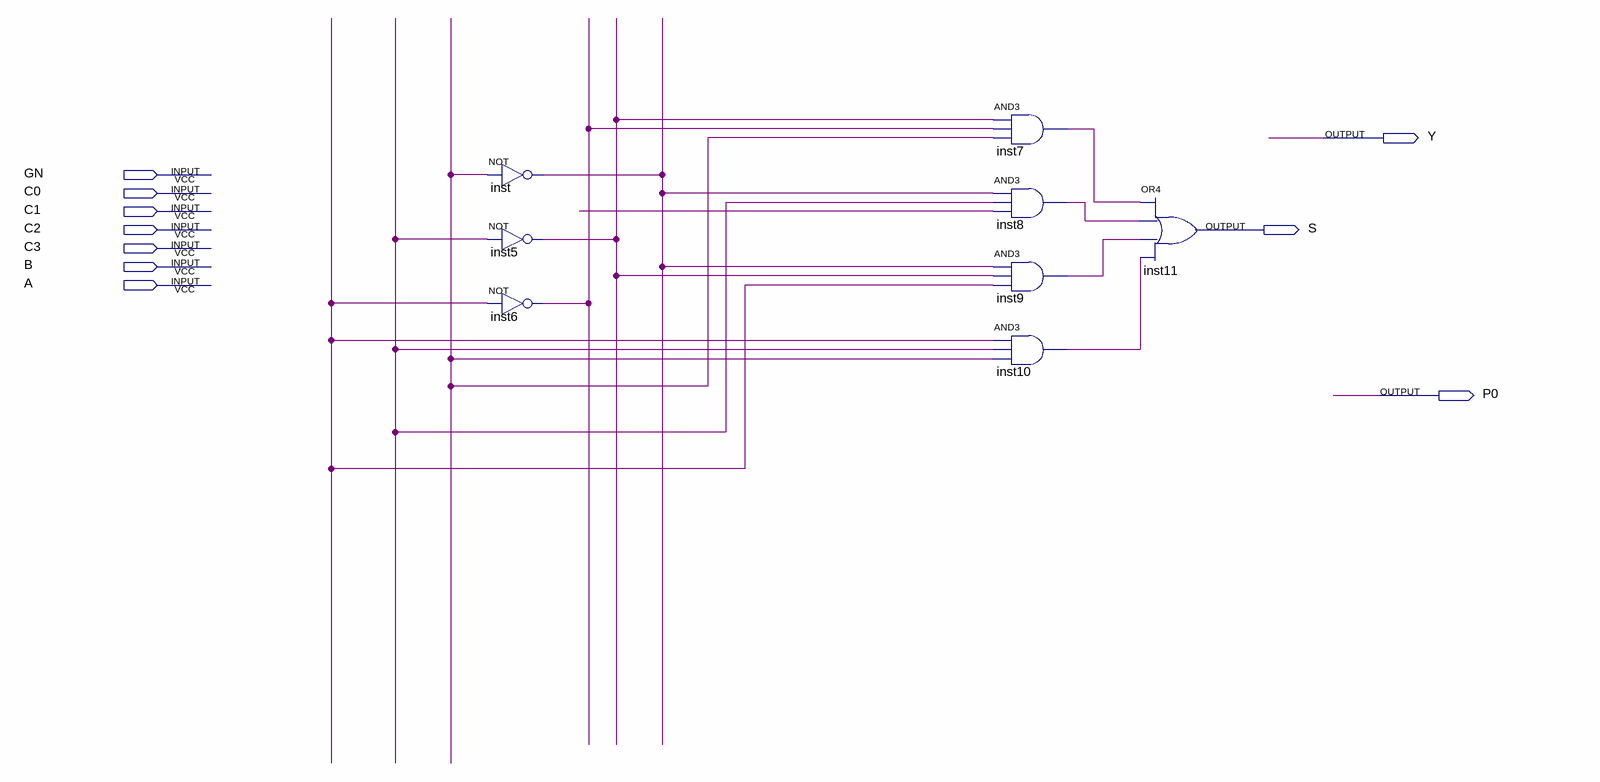
[diagram p0: schematic sheet]
// Quartus schematic CMB5.bdf as structural Verilog: 8 symbols, 10 pins
module CMB5 (
  input  GN,
  input  C0,
  input  C1,
  input  C2,
  input  C3,
  input  B,
  input  A,
  output Y,
  output S,
  output P0
);

  wire inst5_out, inst6_out, inst7_out, inst8_out, inst9_out, inst10_out, inst_out, undriven, undriven_2,
       undriven_3, undriven_4;

  not inst (inst_out, undriven_4);
  not inst5 (inst5_out, undriven_3);
  not inst6 (inst6_out, undriven_2);
  and inst7 (inst7_out, inst5_out, inst6_out, undriven_4);
  and inst8 (inst8_out, inst_out, undriven_3, undriven);
  and inst9 (inst9_out, inst_out, inst5_out, undriven_2);
  and inst10 (inst10_out, undriven_2, undriven_3, undriven_4);
  // OR4 inst11 has open pins: IN1=inst7_out, IN2=inst8_out, IN3=inst9_out, IN4=inst10_out, OUT=open
endmodule
